# Altium schematic sheet Analog power.SchDoc
size A4
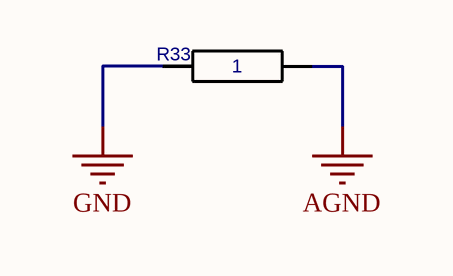
[diagram p0: Analog power.SchDoc]

## Parts
R33  value 1  [R-CHIP]  (hidden comment: RESCHIP)

## Nets
AGND: R33.1(i/o)
GND: R33.2(i/o1)